# EAGLE design loadcellamplifier2 (EAGLE 5.11)
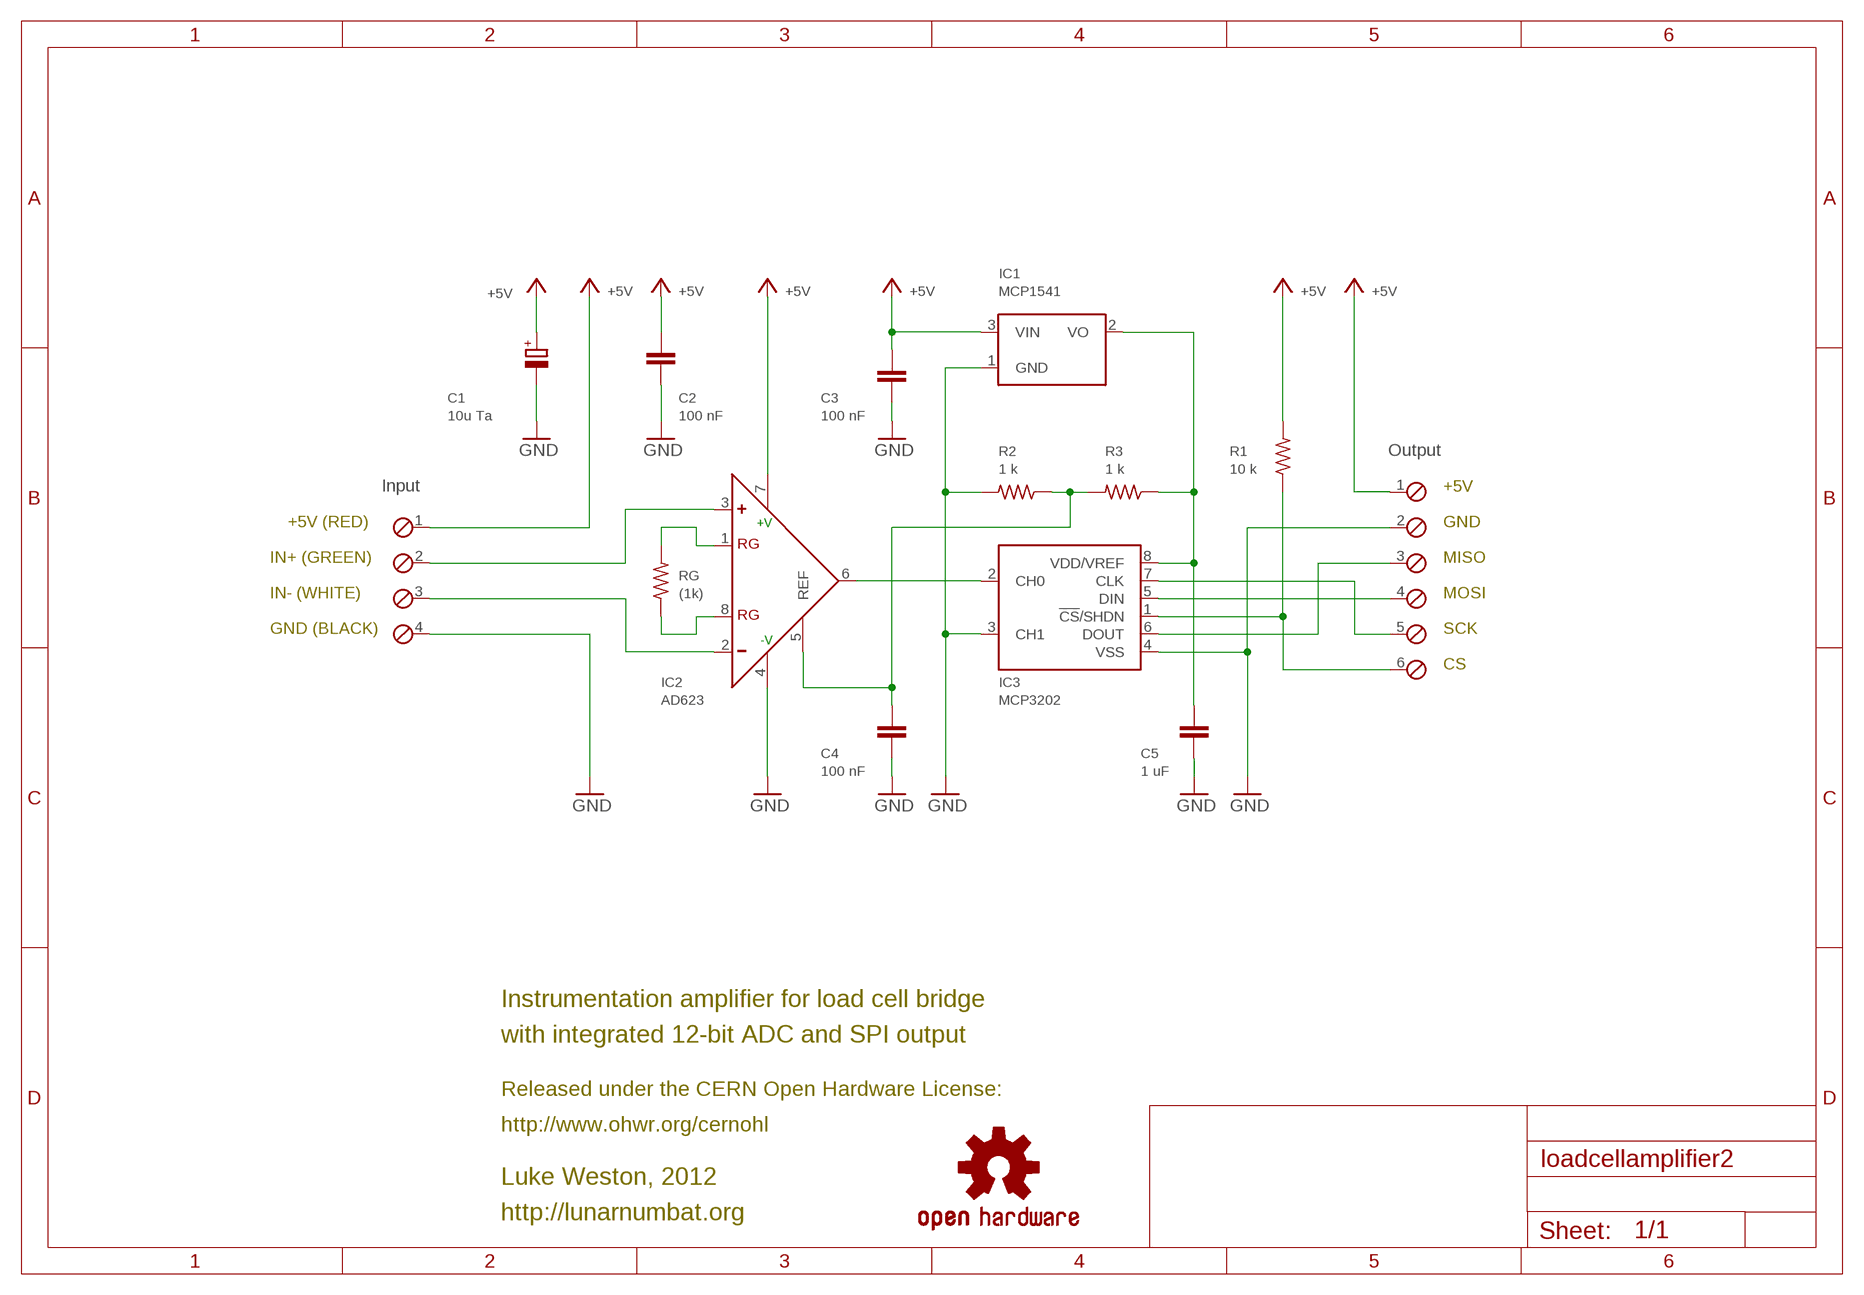
[diagram p0: schematic, sheet 1]

## Parts
C1  10u Ta  CPOL-EUSMCA  [SMC_A]
C2  100 nF  C-EUC0805K  [C0805K]
C3  100 nF  C-EUC0805K  [C0805K]
C4  100 nF  C-EUC0805K  [C0805K]
C5  1 uF  C-EUC0805K  [C0805K]
IC1  MCP1541  MC1541TO  [TO92]
IC2  AD623  AD623N  [DIL08]
IC3  MCP3202  MCP3202P  [DIL8]
J1  Output  MPT6  [6POL254]
J2  Input  MPT4  [4POL254]
R1  10 k  R-US_M0805  [M0805]
R2  1 k  R-US_M0805  [M0805]
R3  1 k  R-US_M0805  [M0805]
RG  (1k)  R-US_0207/10  [0207/10]
U$  OSHW-LOGOS  [OSHW-LOGO-S]

## Nets
+5V: C1.+ C2.1 C3.1 IC1.3(VIN) IC2.7(+V) J1.1 J2.1 R1.2
CS: IC3.1(!CS!/SHDN) J1.6 R1.1
GND: C1.- C2.2 C3.2 C4.2 C5.2 IC1.1(GND) IC2.4(-V) IC3.3(CH1) IC3.4(VSS) J1.2 J2.4 R2.2
MISO: IC3.6(DOUT) J1.3
MOSI: IC3.5(DIN) J1.4
N$1: IC2.8(RG) RG.1
N$2: IC2.1(RG) RG.2
N$3: IC2.3(+) J2.2
N$4: IC2.2(-) J2.3
N$5: IC2.6(OUT) IC3.2(CH0)
N$13: C5.1 IC1.2(VO) IC3.8(VDD/VREF) R3.1
N$17: C4.1 IC2.5(REF) R2.1 R3.2
SCK: IC3.7(CLK) J1.5

## Notes on the sheet
- +5V
- +5V (RED) | GND
- IN+ (GREEN) | MISO
- IN- (WHITE) | MOSI
- GND (BLACK) | SCK
- CS
- Instrumentation amplifier for load cell bridge
- with integrated 12-bit ADC and SPI output
- Released under the CERN Open Hardware License:
- http://www.ohwr.org/cernohl
- Luke Weston, 2012
- http://lunarnumbat.org

## Library data of the parts
C1 = rcl:CPOL-EU: POLARIZED CAPACITOR, European symbol
C2-C5 = rcl:C-EU: CAPACITOR, European symbol
IC1 = microchip:MC15*: 2.5V and 4.096V Voltage References Source: http://www.microchip.com .. 21653b.pdf; OC_FARNELL: unknown; OC_NEWARK: unknown
IC2 = analog-devices:AD623: Single-Supply, Rail-to-Rail, Low Cost Instrumentation Amplifier Source: http://www.analog.com/static/imported-files/data_sheets/AD623.pdf; MF: ALTERA CORPORATION; MPN: AD623ANZ; OC_FARNELL: 9603700; OC_NEWARK: 59K4402
IC3 = microchip:MCP3202: 2.7V Dual Channel 12-Bit A/D Converter with SPI Serial Interface Source: http://ww1.microchip.com/downloads/en/DeviceDoc/21034D.pdf; MF: MICROCHIP; MPN: MCP3202-CI/P; OC_FARNELL: 1196794; OC_NEWARK: 72K7287
J1 = con-phoenix-254:MPT6: PHOENIX CONNECTOR; OC_FARNELL: unknown; OC_NEWARK: unknown
J2 = con-phoenix-254:MPT4: PHOENIX CONNECTOR; OC_FARNELL: unknown; OC_NEWARK: unknown
R1-R3 RG = rcl:R-US_: RESISTOR, American symbol
U$ = SparkFun:OSHW-LOGO: Open Source Hardware Logo This logo indicates the piece of hardware it is found on incorporates a OSHW license and/or adheres to the definition of open source hardware found here: http://freedomdefined.org/OSHW

## Board
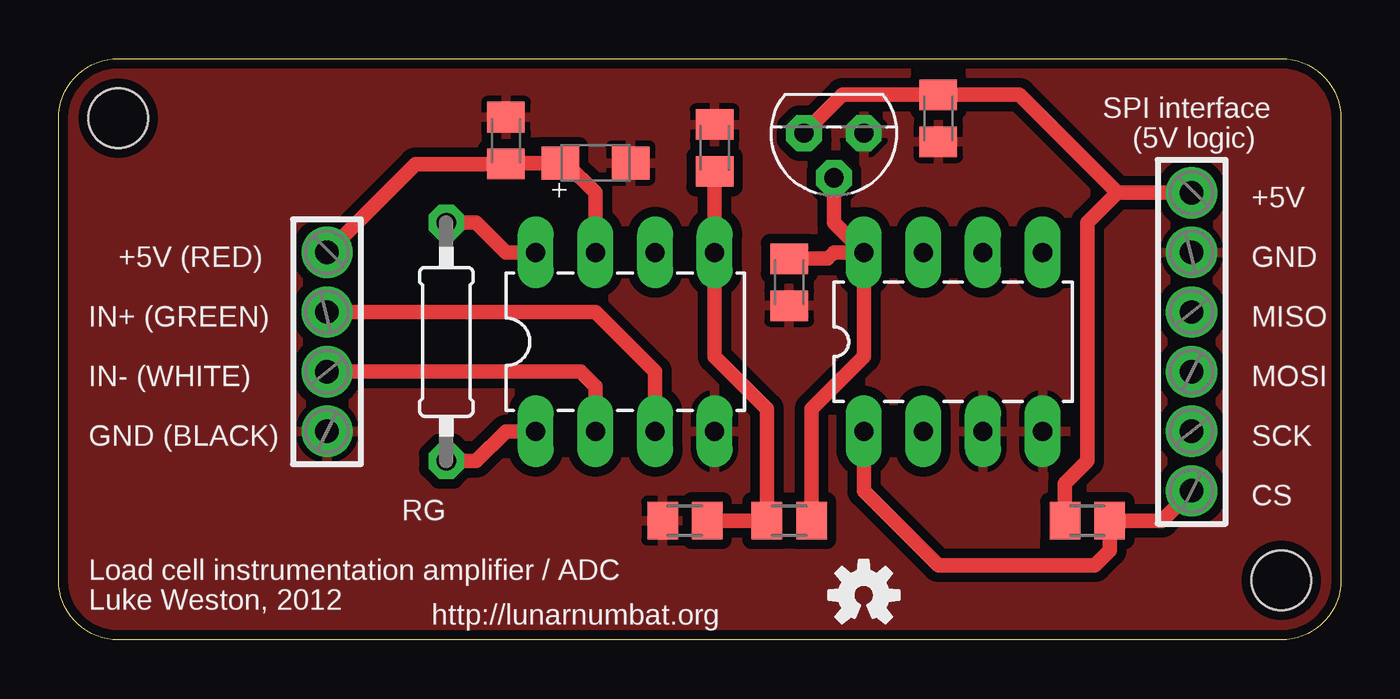
[diagram p1: board, top side]
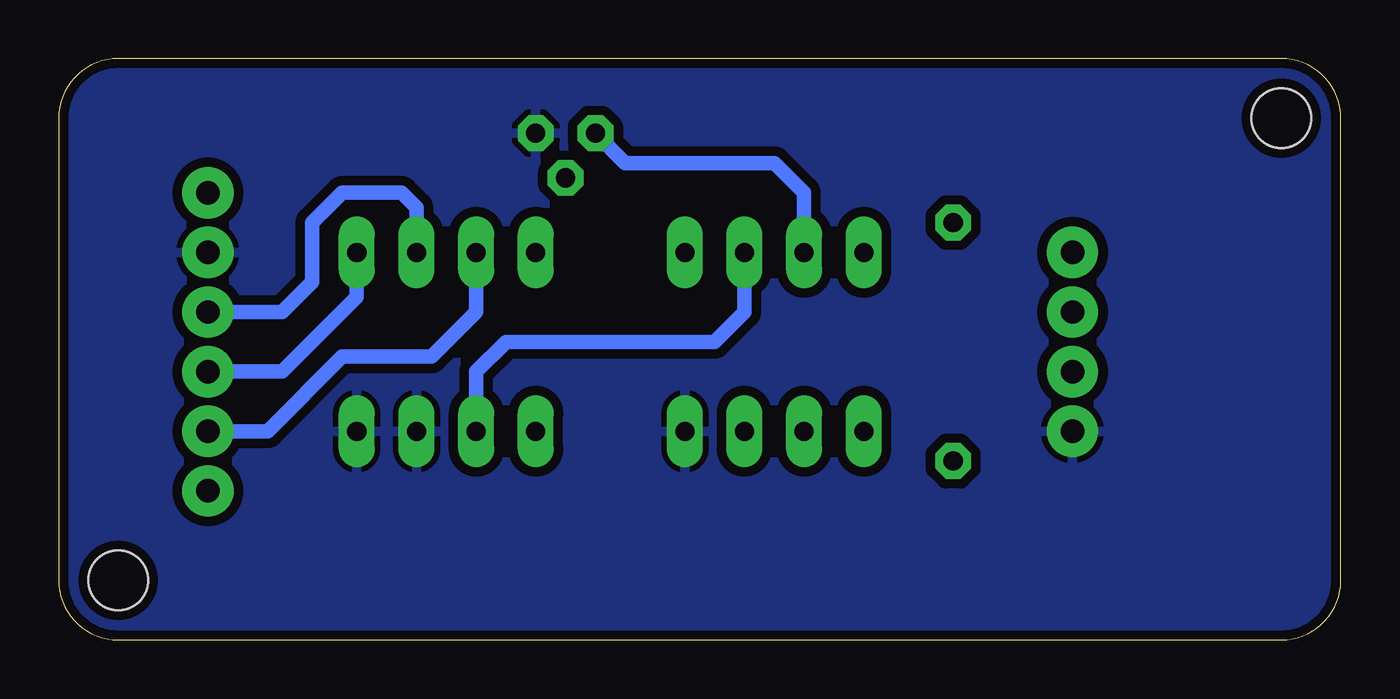
[diagram p2: board, bottom side, seen from below]

Size 54.61 x 24.77 mm. Coordinates in mm from the lower left corner, seen from the top.
Outline: 0,22.23 arc-90 2.54,24.77 52.07,24.77 arc-90 54.61,22.23 54.61,2.54 arc-90 52.07,0 2.54,0 arc-90 0,2.54 0,22.23
Copper layers (1*16): Top 0.035mm / dielectric 1.5mm / Bottom 0.035mm
Design rules "freetronics": minimum track width 8mil, minimum drill 15mil, track to track 10mil, track to pad 10mil, pad to pad 10mil, via to via 10mil, smd to smd 8mil, copper to edge 10mil, drill to drill 8mil, minimum pad ring 14mil, minimum via ring 8mil, stop-mask expansion 4mil, vias tented up to drill 25mil, thermal gap 10mil
Holes 2.54 mm at 2.54,22.23 52.07,2.54

### Footprints (pad centres in the part's own frame; a part is rotated, then mirrored left to right if it is on the bottom)
SMC_A = smd 1.6 x 1.4: + -1.5,0; - 1.5,0
C0805K = smd 1.3 x 1.6: 1 -1,0; 2 1,0
TO92 = drill 0.813 octagon: 1 -1.27,0; 2 0,1.905; 3 1.27,0
DIL08 = drill 0.813 long: 1 -3.81,-3.81; 2 -1.27,-3.81; 3 1.27,-3.81; 4 3.81,-3.81; 5 3.81,3.81; 6 1.27,3.81; 7 -1.27,3.81; 8 -3.81,3.81
DIL8 = drill 0.813 long: 1 -3.81,-3.81; 2 -1.27,-3.81; 3 1.27,-3.81; 4 3.81,-3.81; 5 3.81,3.81; 6 1.27,3.81; 7 -1.27,3.81; 8 -3.81,3.81
6POL254 = drill 1 pad 2.184 round: 1 -6.35,0; 2 -3.81,0; 3 -1.27,0; 4 1.27,0; 5 3.81,0; 6 6.35,0
4POL254 = drill 1 pad 2.184 round: 1 -3.81,0; 2 -1.27,0; 3 1.27,0; 4 3.81,0
M0805 = smd 1.3 x 1.6: 1 -0.95,0; 2 0.95,0
0207/10 = drill 0.813 octagon: 1 -5.08,0; 2 5.08,0

### Placement (x,y rotation side)
C1  22.86,20.32 0 top
C2  19.05,21.27 90 top
C3  37.46,22.23 270 top
C4  27.94,20.96 90 top
C5  31.12,15.24 270 top
IC1  33.02,21.59 180 top
IC2  24.13,12.7 0 top
IC3  38.1,12.7 0 top
J1  48.26,12.7 270 top
J2  11.43,12.7 270 top
R1  43.81,5.08 180 top
R2  26.67,5.08 180 top
R3  31.12,5.08 180 top
RG  16.51,12.7 270 top
U$  34.29,1.9 0 top

### Tracks (layer width: path | path; a pad name or v marks a point on that pad's centre or on a via)
+5V
  Top 0.61: R1.2 42.87,6.67 43.81,7.62 43.81,17.78 45.09,19.05 | 45.09,19.05 J1.1 | IC2.7 22.86,19.05 21.59,20.32 C1.+ 19.1,20.32 C2.1 15.19,20.27 J2.1 | IC1.3 33.38,23.23 C3.1 40.91,23.23 45.09,19.05
  Bottom 0.61: IC2.7 22.86,19.05 24.13,20.32 30.48,20.32 IC1.3
CS
  Top 0.61: J1.6 46.99,5.08 R1.1 44.77,3.81 44.13,3.18 37.46,3.18 34.29,6.35 IC3.1
GND
  pour Bottom (isolate 0.406): -1.91,26.04 55.88,26.04 55.88,-1.27 -1.91,-1.27
  pour Top (isolate 0.406): -1.91,26.04 55.88,26.04 55.88,-1.27 -1.91,-1.27
MISO
  Bottom 0.61: J1.3 45.09,13.97 43.81,15.24 43.81,17.78 42.55,19.05 40,19.05 39.37,18.41 IC3.6
MOSI
  Bottom 0.61: J1.4 45.09,11.43 41.91,14.61 IC3.5
N$1
  Top 0.61: RG.1 17.78,17.78 19.05,16.51 IC2.8
N$2
  Top 0.61: RG.2 17.78,7.62 19.05,8.89 IC2.1
N$3
  Top 0.61: J2.2 22.86,13.97 25.4,11.43 IC2.3
N$4
  Top 0.61: J2.3 22.22,11.43 22.86,10.79 IC2.2
N$5
  Bottom 0.61: IC3.2 36.83,11.43 35.56,12.7 26.67,12.7 25.4,13.97 IC2.6
N$13
  Top 0.61: IC1.2 33.02,17.78 IC3.8 | R3.1 32.06,9.84 34.29,12.07 IC3.8 | C5.1 32.75,16.24 33.02,16.51 IC3.8
N$17
  Top 0.61: R2.1 R3.2 30.16,9.84 27.94,12.07 IC2.5 C4.1
SCK
  Bottom 0.61: J1.5 45.72,8.89 42.55,12.07 38.73,12.07 36.83,13.97 IC3.7

### Text on the board
tPlace: SPI interface | (5V logic) | + | +5V | +5V (RED) | GND | IN+ (GREEN) | MISO | IN- (WHITE) | MOSI | GND (BLACK) | SCK | CS | RG | Load cell instrumentation amplifier / ADC | Luke Weston, 2012 | http://lunarnumbat.org